# Altium schematic sheet connector-bottom-j2-1.SchDoc: Connector - J2(Bottom) 1
size Letter; CompanyName: Brinton Engineering, LLC; Address1: 3479 Edison Way; Address2: Menlo Park CA 94025; Address3: +1 (877) 778-8435; Address4: brintonengineering.com; Revision: 1; SheetNumber: 1; SheetTotal: 1
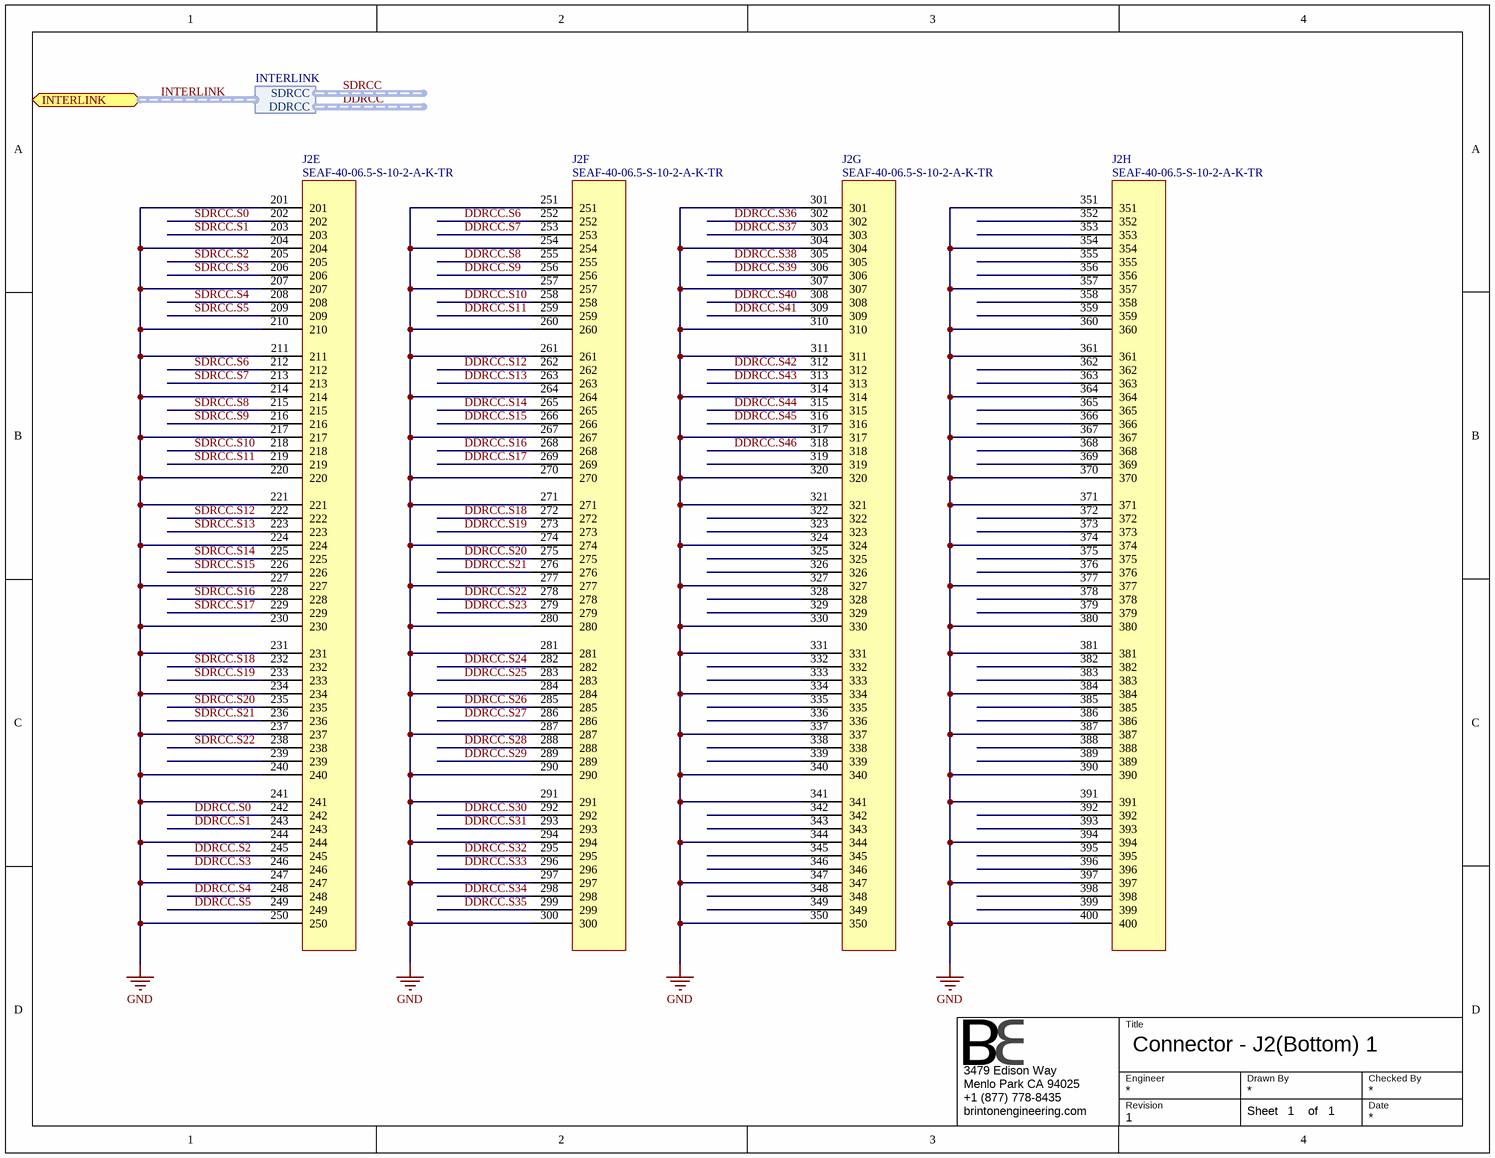
[diagram p0: connector-bottom-j2-1.SchDoc]

## Parts
J2  SEAF-40-06.5-S-10-2-A-K-TR  [SEAF-40-06.5-S-10-2-A-K-TR]  (parts E,F,G,H of 8)

## Ports
INTERLINK (harness INTERLINK)

## Harnesses
INTERLINK: DDRCC, SDRCC

## Nets
GND: J2.201 J2.204 J2.207 J2.210 J2.211 J2.214 J2.217 J2.220 J2.221 J2.224 J2.227 J2.230 J2.231 J2.234 J2.237 J2.240 J2.241 J2.244 J2.247 J2.250 J2.251 J2.254 J2.257 J2.260 J2.261 J2.264 J2.267 J2.270 J2.271 J2.274 J2.277 J2.280 J2.281 J2.284 J2.287 J2.290 J2.291 J2.294 J2.297 J2.300 J2.301 J2.304 J2.307 J2.310 J2.311 J2.314 J2.317 J2.320 J2.321 J2.324 J2.327 J2.330 J2.331 J2.334 J2.337 J2.340 J2.341 J2.344 J2.347 J2.350 J2.351 J2.354 J2.357 J2.360 J2.361 J2.364 J2.367 J2.370 J2.371 J2.374 J2.377 J2.380 J2.381 J2.384 J2.387 J2.390 J2.391 J2.394 J2.397 J2.400
DDRCC.S0: J2.242
DDRCC.S1: J2.243
DDRCC.S2: J2.245
DDRCC.S3: J2.246
DDRCC.S4: J2.248
DDRCC.S5: J2.249
DDRCC.S6: J2.252
DDRCC.S7: J2.253
DDRCC.S8: J2.255
DDRCC.S9: J2.256
DDRCC.S10: J2.258
DDRCC.S11: J2.259
DDRCC.S12: J2.262
DDRCC.S13: J2.263
DDRCC.S14: J2.265
DDRCC.S15: J2.266
DDRCC.S16: J2.268
DDRCC.S17: J2.269
DDRCC.S18: J2.272
DDRCC.S19: J2.273
DDRCC.S20: J2.275
DDRCC.S21: J2.276
DDRCC.S22: J2.278
DDRCC.S23: J2.279
DDRCC.S24: J2.282
DDRCC.S25: J2.283
DDRCC.S26: J2.285
DDRCC.S27: J2.286
DDRCC.S28: J2.288
DDRCC.S29: J2.289
DDRCC.S30: J2.292
DDRCC.S31: J2.293
DDRCC.S32: J2.295
DDRCC.S33: J2.296
DDRCC.S34: J2.298
DDRCC.S35: J2.299
DDRCC.S36: J2.302
DDRCC.S37: J2.303
DDRCC.S38: J2.305
DDRCC.S39: J2.306
DDRCC.S40: J2.308
DDRCC.S41: J2.309
DDRCC.S42: J2.312
DDRCC.S43: J2.313
DDRCC.S44: J2.315
DDRCC.S45: J2.316
DDRCC.S46: J2.318
SDRCC.S0: J2.202
SDRCC.S1: J2.203
SDRCC.S2: J2.205
SDRCC.S3: J2.206
SDRCC.S4: J2.208
SDRCC.S5: J2.209
SDRCC.S6: J2.212
SDRCC.S7: J2.213
SDRCC.S8: J2.215
SDRCC.S9: J2.216
SDRCC.S10: J2.218
SDRCC.S11: J2.219
SDRCC.S12: J2.222
SDRCC.S13: J2.223
SDRCC.S14: J2.225
SDRCC.S15: J2.226
SDRCC.S16: J2.228
SDRCC.S17: J2.229
SDRCC.S18: J2.232
SDRCC.S19: J2.233
SDRCC.S20: J2.235
SDRCC.S21: J2.236
SDRCC.S22: J2.238

Not connected (* = marked no-connect by the designer): J2 239 319 322 323 325 326 328 329 332 333 335 336 338 339 342 343 345 346 348 349 352 353 355 356 358 359 362 363 365 366 368 369 372 373 375 376 378 379 382 383 385 386 388 389 392 393 395 396 398 399

## Buses and harness runs
harness INTERLINK = port INTERLINK

## Notes on the sheet
- Title
- Engineer
- Revision
- Drawn By
- Checked By
- Date
- Sheet
- of

## Library data of the parts
J2 = SEAF-40-06.5-S-10-2-A-K-TR: Terminal Array Assembly, Surface Mount, 0.050" Pitch, 400 Pins; Manufacturer: Samtec; Manufacturer P/N: SEAF-40-06.5-S-10-2-A-K-TR